# EAGLE design v0.3.0 (EAGLE 9.2.2)

## Sheet 1 of 2: Interface
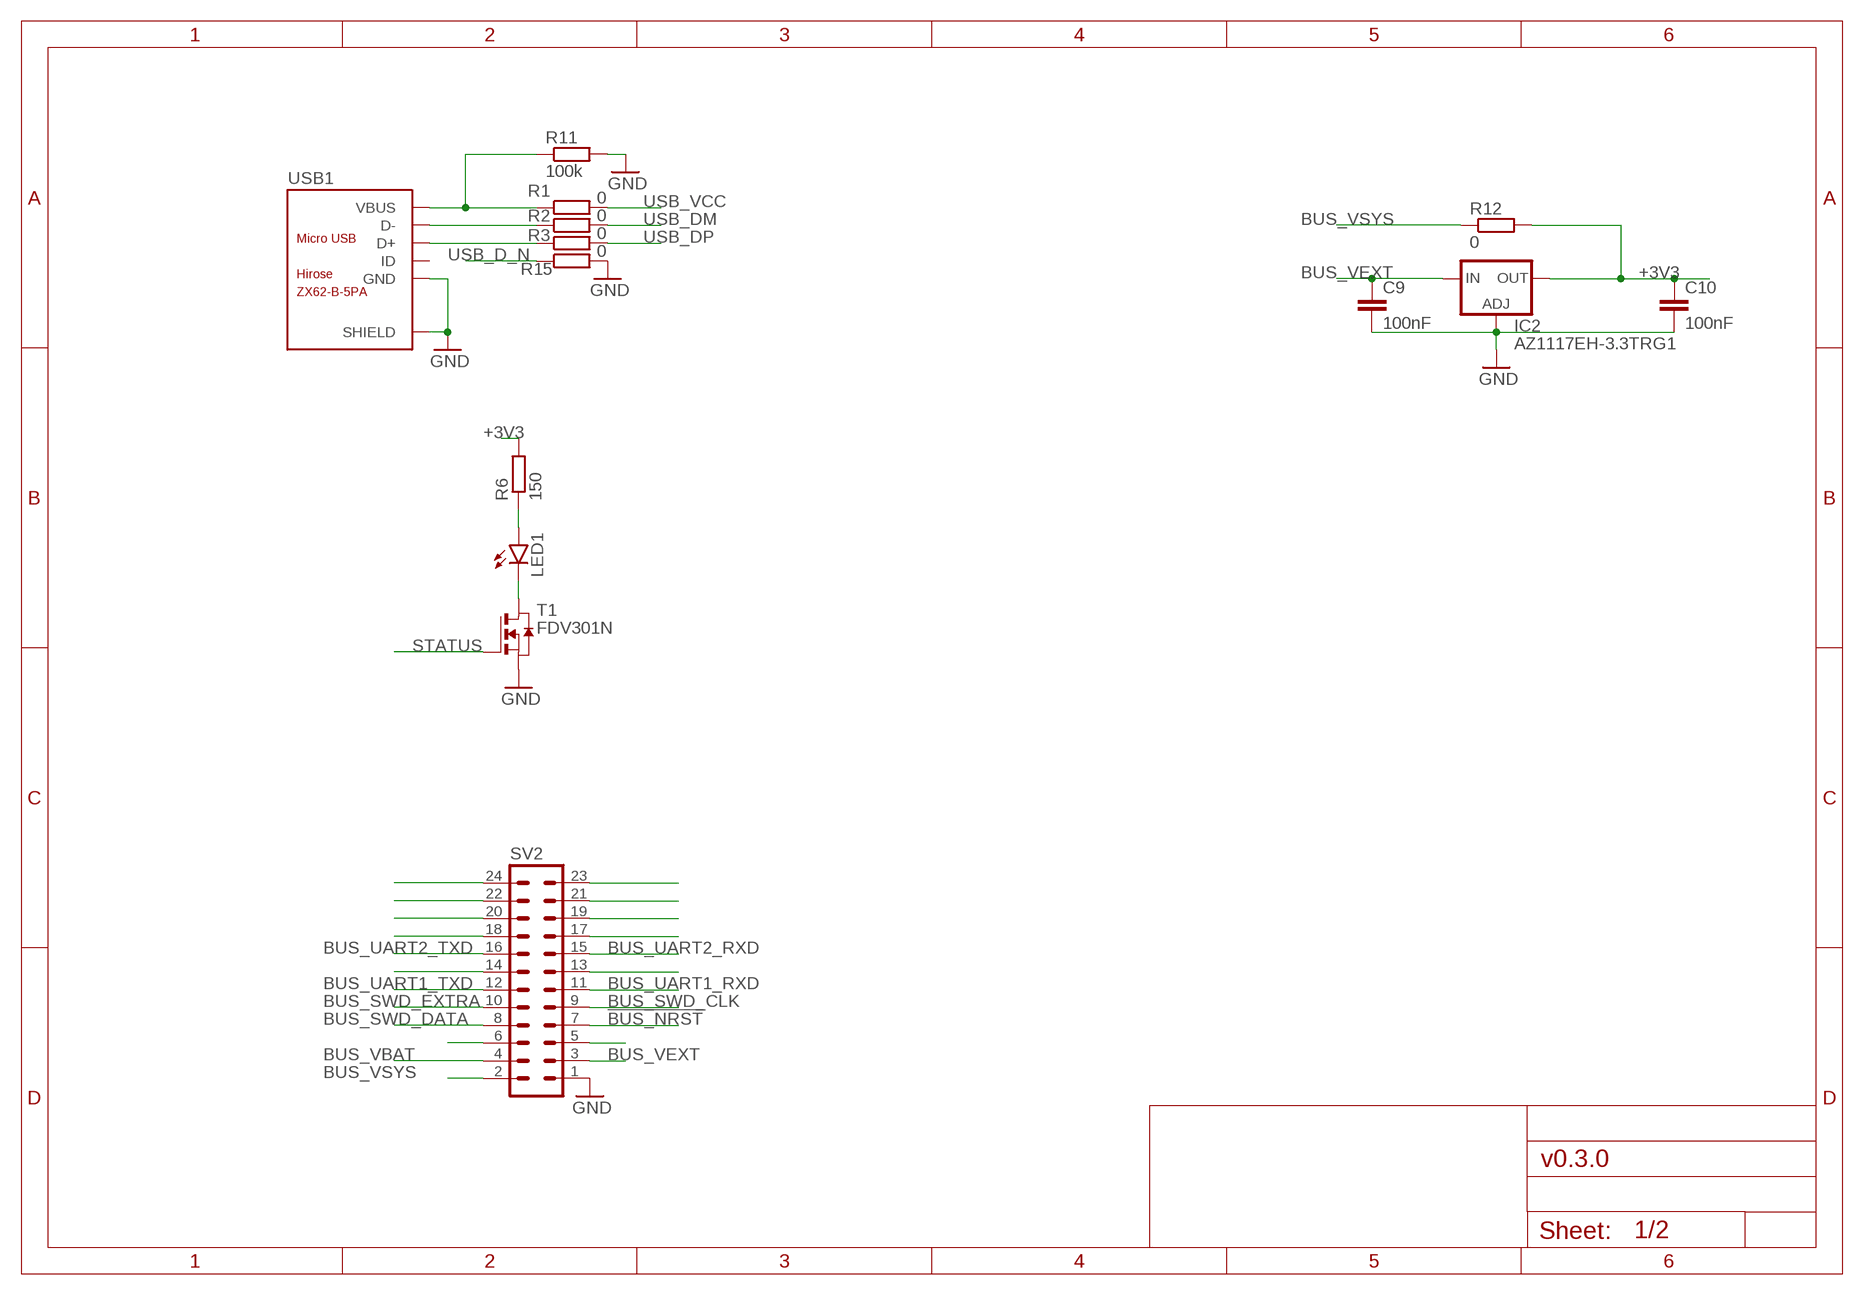
[diagram p0: schematic, sheet 1]

### Parts
C9  100nF  C-EUC0603  [C0603]
C10  100nF  C-EUC0603  [C0603]
IC2  AZ1117EH-3.3TRG1  LD117AS33TR  [SOT223]
LED1  LEDCHIP-LED0603  [CHIP-LED0603]
R1  0  R-EU_R0402  [R0402]
R2  0  R-EU_R0402  [R0402]
R3  0  R-EU_R0402  [R0402]
R6  150  R-EU_R0402  [R0402]
R11  100k  R-EU_R0402  [R0402]
R12  0  R-EU_R0402  [R0402]
R15  0  R-EU_R0402  [R0402]
SV2  MA12-2  [MA12-2]
T1  FDV301N  NMOSSOT23  [SOT-23]
USB1  ZX62-B-5PA  MICRO-USB-SMD(ZX62-B-5PA)  [MICRO-USB5+6P-SMD-0.65-AB]

### Nets
!BUS_NRST: SV2.7
+3V3: C10.1 IC2.4(OUT) R6.2 R12.2 ; also sheet 2
BUS_SWD_CLK: SV2.9
BUS_SWD_DATA: SV2.8
BUS_SWD_EXTRA: SV2.10
BUS_UART1_RXD: SV2.11 ; also sheet 2
BUS_UART1_TXD: SV2.12 ; also sheet 2
BUS_UART2_RXD: SV2.15
BUS_UART2_TXD: SV2.16
BUS_VBAT: SV2.4
BUS_VEXT: C9.1 IC2.3(IN) SV2.3
BUS_VSYS: R12.1 SV2.2
GND: C9.2 C10.2 IC2.1(ADJ) R11.2 R15.2 SV2.1 T1.2(S) USB1.5(GND) USB1.P1(SHIELD) USB1.P2(SHIELD) USB1.P3(SHIELD) USB1.P4(SHIELD) USB1.P5(SHIELD) USB1.P6(SHIELD) ; also sheet 2
N$6: LED1.C T1.1(D)
N$7: SV2.13
N$10: SV2.14
N$12: LED1.A R6.1
N$16: SV2.18
N$23: SV2.17
N$24: SV2.5
N$25: SV2.6
N$26: SV2.20
N$27: SV2.19
N$28: SV2.21
N$29: SV2.23
N$30: SV2.24
N$31: SV2.22
STATUS: T1.3(G) ; also sheet 2
USB_D_N [usb_dif]: R2.1 R15.1 USB1.2(D-)
USB_D_P [usb_dif]: R3.1 USB1.3(D+)
USB_DM [usb_dif]: R2.2 ; also sheet 2
USB_DP [usb_dif]: R3.2 ; also sheet 2
USB_VCC: R1.2 ; also sheet 2
VBUS: R1.1 R11.1 USB1.1(VBUS)
Unconnected: USB1.4(ID)

## Sheet 2 of 2: GPS modem
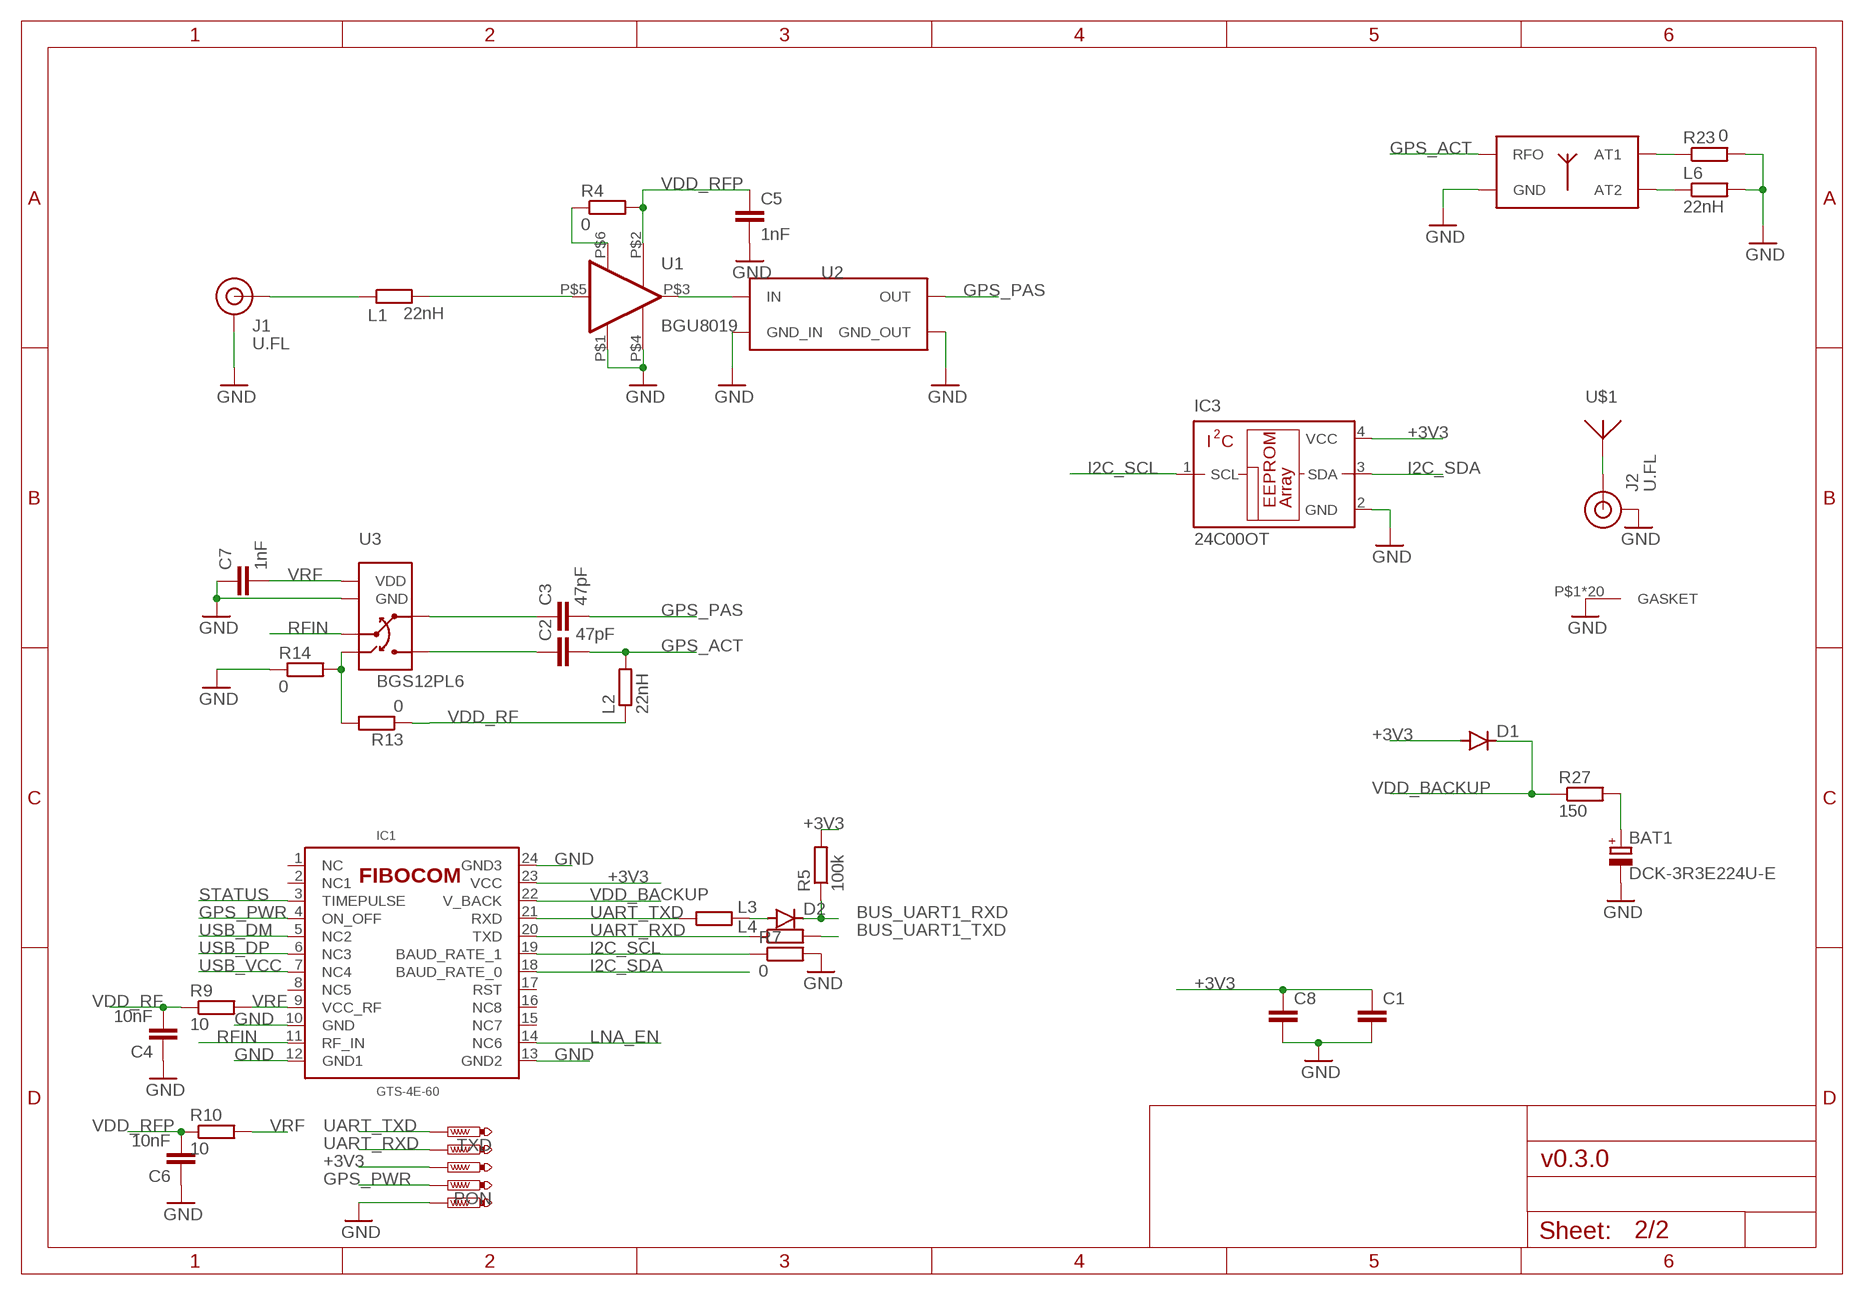
[diagram p1: schematic, sheet 2]

### Parts
3V3  PTR1B1,27  [B1,27]
ANT1  M20047  [PCBCOMPONENT_1]
BAT1  DCK-3R3E224U-E  [621]
C1  C-EUC0603  [C0603]
C2  47pF  C-EUC0402  [C0402]
C3  47pF  C-EUC0402  [C0402]
C4  10nF  C-EUC0402  [C0402]
C5  1nF  C-EUC0402  [C0402]
C6  10nF  C-EUC0402  [C0402]
C7  1nF  C-EUC0402  [C0402]
C8  C-EUC0402  [C0402]
D1  DIODE-SOD323-R  [SOD323-R]
D2  DIODE-SOD323-R  [SOD323-R]
GND  PTR1B1,27  [B1,27]
IC1  GTS-4E-60  [_GTS_4E_60]
IC3  24C00OT  [SOT23-5L]
J1  U.FL  U.FL2PIN  [U.FL]
J2  U.FL  U.FL2PIN  [U.FL]
L1  22nH  R-EU_R0402  [R0402]
L2  22nH  R-EU_R0402  [R0402]
L3  R-EU_R0402  [R0402]
L4  R-EU_R0402  [R0402]
L6  22nH  R-EU_R0402  [R0402]
PON  PTR1B1,27  [B1,27]
R4  0  R-EU_R0402  [R0402]
R5  100k  R-EU_R0402  [R0402]
R7  0  R-EU_R0402  [R0402]
R9  10  R-EU_R0402  [R0402]
R10  10  R-EU_R0402  [R0402]
R13  0  R-EU_R0402  [R0402]
R14  0  R-EU_R0402  [R0402]
R23  0  R-EU_R0402  [R0402]
R27  150  R-EU_R0402  [R0402]
RXD  PTR1B1,27  [B1,27]
TXD  PTR1B1,27  [B1,27]
U1  BGU8019  [XSON6]
U2  B3916B8813P810  [XSON5]
U3  BGS12PL6  [TSLP-6-4]
U$1  ANT1590-2540A  [2540A]
U$2  2118718-2  [2118717-2]

### Nets
+3V3: 3V3.TP C1.1 C8.1 D1.A IC1.23(VCC) IC3.4(VCC) R5.2 ; also sheet 1
BUS_UART1_RXD: D2.C R5.1 ; also sheet 1
BUS_UART1_TXD: L4.2 ; also sheet 1
GND: ANT1.2(GND) ANT1.3(GND) ANT1.4(GND) BAT1.- C1.2 C4.1 C5.2 C6.1 C7.1 C8.2 GND.TP IC1.10(GND) IC1.12(GND1) IC1.13(GND2) IC1.24(GND3) IC3.2(GND) J1.1(GND) J1.2(GND) J2.1(GND) J2.2(GND) L6.2 R7.2 R14.1 R23.2 U1.P$1(GND) U1.P$4(GND_RF) U2.2(GND_IN) U2.3(GND_OUT) U2.5(GND_IN) U3.P$2(GND) U$2.P$1(GASKET) U$2.P$2(GASKET) U$2.P$3(GASKET) U$2.P$4(GASKET) U$2.P$5(GASKET) U$2.P$6(GASKET) U$2.P$7(GASKET) U$2.P$8(GASKET) U$2.P$9(GASKET) U$2.P$10(GASKET) U$2.P$11(GASKET) U$2.P$12(GASKET) U$2.P$13(GASKET) U$2.P$14(GASKET) U$2.P$15(GASKET) U$2.P$16(GASKET) U$2.P$17(GASKET) U$2.P$18(GASKET) U$2.P$19(GASKET) U$2.P$20(GASKET) ; also sheet 1
GPS_ACT: ANT1.5(RFO) C2.2 L2.2
GPS_PAS: C3.2 U2.4(OUT)
GPS_PWR: IC1.4(ON_OFF) PON.TP
I2C_SCL: IC1.19(BAUD_RATE_1) IC3.1(SCL) R7.1
I2C_SDA: IC1.18(BAUD_RATE_0) IC3.3(SDA)
LNA_EN: IC1.14(NC6)
N$1 [50_feed]: J2.FEED(SIGNAL) U$1.P$1
N$2: U1.P$3(RF_OUT) U2.1(IN)
N$3: R4.1 U1.P$6(ENABLE)
N$4: L1.2 U1.P$5(RF_IN)
N$5 [50_feed]: J1.FEED(SIGNAL) L1.1
N$11: R13.2 R14.2 U3.P$6
N$13: C3.1 U3.P$3(RF1)
N$14: C2.1 U3.P$1(RF2)
N$17: ANT1.1(AT1) R23.1
N$18: ANT1.6(AT2) L6.1
N$20: BAT1.+ R27.2
N$21: D2.A L3.2
RFIN: IC1.11(RF_IN) U3.P$5(RFIN)
STATUS: IC1.3(TIMEPULSE) ; also sheet 1
UART_RXD: IC1.20(TXD) L4.1 RXD.TP
UART_TXD: IC1.21(RXD) L3.1 TXD.TP
USB_DM [usb_dif]: IC1.5(NC2) ; also sheet 1
USB_DP [usb_dif]: IC1.6(NC3) ; also sheet 1
USB_VCC: IC1.7(NC4) ; also sheet 1
VDD_BACKUP: D1.C IC1.22(V_BACK) R27.1
VDD_RF: C4.2 L2.1 R9.1 R13.1
VDD_RFP: C5.1 C6.2 R4.2 R10.1 U1.P$2(VCC)
VRF: C7.2 IC1.9(VCC_RF) R9.2 R10.2 U3.P$4(VDD)
Unconnected: IC1.1(NC) IC1.2(NC1) IC1.8(NC5) IC1.15(NC7) IC1.16(NC8) IC1.17(RST)

## Library data of the parts
3V3 GND PON RXD TXD = testpad:PTR1: TEST PIN
ANT1 = antenova:M20047
BAT1 = elna:DCK-3R3E224U-E
C1-C10 = rcl:C-EU: CAPACITOR, European symbol; SPICEPREFIX: C
D1 D2 = diode:DIODE-: DIODE
IC1 = parts-fibocom:GTS-4E-60: The GTS-4E is a new generation of GPS receiving module. FIBOCOM GTS 4E 60
IC2 = v-reg:LD117A?*: Low drop fixed and adjustable positive voltage regulators 1 A Source: http://www.st.com/stonline/products/literature/ds/7194/ld1117axx.pdf
IC3 = microchip:24*00: Serial EEPROM 128 bit, I2C (AA = 1.8 V/LC = 2.5 V/C = 5.0 V); MF: MICROCHIP; MPN: 24C00T-I/OT; OC_FARNELL: 1818713; OC_NEWARK: 92C6937
J1 J2 = SparkFun-Connectors:U.FL2PIN: SMD Antenna Connector - U.FL 2mm height, 3.0mm x 3.0mm receptacle size. SparkFun Products: SparkFun WiFi Shield - ESP8266 <https://www.sparkfun.com/products/13287> SparkFun ESP8266 Thing <https://www.sparkfun.com/products/13231> SparkFun MiniGen - Pro Mini Signal Generator Shield <https://www.sparkfun.com/products/11420>; PROD_ID: CONN-09193; SF_ID: WRL-09144
L1-L4 L6 R1-R7 R9-R15 R23 R27 = rcl:R-EU_: RESISTOR, European symbol; SPICEPREFIX: R
LED1 = led:LED: LED OSRAM: - CHIPLED LG R971, LG N971, LY N971, LG Q971, LY Q971, LO R971, LY R971 LH N974, LH R974 LS Q976, LO Q976, LY Q976 LO Q996 - Hyper CHIPLED LW Q18S LB Q993, LB Q99A, LB R99A - SideLED LS A670, LO A670, LY A670, LG A670, LP A670 LB A673, LV A673, LT A673, LW A673 LH A674 LY A675 LS A676, LA A676, LO A676, LY A676, LW A676 LS A679, LY A679, LG A679 - Hyper Micro SIDELED® LS Y876, LA Y876, LO Y876, LY Y876 LT Y87S - SmartLED LW L88C, LW L88S LB L89C, LB L89S, LG L890 LS L89K, LO L89K, LY L89K LS L896, LA L896, LO L896, LY L896 - TOPLED LS T670, LO T670, LY T670, LG T670, LP T670 LSG T670, LSP T670, LSY T670, LOP T670, LYG T670 LG T671, LOG T671, LSG T671 LB T673, LV T673, LT T673, LW T673 LH T674 LS T676, LA T676, LO T676, LY T676, LB T676, LH T676, LSB T676, LW T676 LB T67C, LV T67C, LT T67C, LS T67K, LO T67K, LY T67K, LW E67C LS E67B, LA E67B, LO E67B, LY E67B, LB E67C, LV E67C, LT E67C LW T67C LS T679, LY T679, LG T679 LS T770, LO T770, LY T770, LG T770, LP T770 LB T773, LV T773, LT T773, LW T773 LH T774 LS E675, LA E675, LY E675, LS T675 LS T776, LA T776, LO T776, LY T776, LB T776 LHGB T686 LT T68C, LB T68C - Hyper Mini TOPLED® LB M676 - Mini TOPLED Santana® LG M470 LS M47K, LO M47K, LY M47K Source: http://www.osram.convergy.de LUXEON: - LUMILED® LXK2-PW12-R00, LXK2-PW12-S00, LXK2-PW14-U00, LXK2-PW14-V00 LXK2-PM12-R00, LXK2-PM12-S00, LXK2-PM14-U00 LXK2-PE12-Q00, LXK2-PE12-R00, LXK2-PE12-S00, LXK2-PE14-T00, LXK2-PE14-U00 LXK2-PB12-K00, LXK2-PB12-L00, LXK2-PB12-M00, LXK2-PB14-N00, LXK2-PB14-P00, LXK2-PB14-Q00 LXK2-PR12-L00, LXK2-PR12-M00, LXK2-PR14-Q00, LXK2-PR14-R00 LXK2-PD12-Q00, LXK2-PD12-R00, LXK2-PD12-S00 LXK2-PH12-R00, LXK2-PH12-S00 LXK2-PL12-P00, LXK2-PL12-Q00, LXK2-PL12-R00 Source: www.luxeon.com KINGBRIGHT: KA-3528ASYC Source: www.kingbright.com
SV2 = con-lstb:MA12-2: PIN HEADER; OC_FARNELL: unknown; OC_NEWARK: unknown
T1 = zetex:NMOSSOT23: MOS FET; OC_FARNELL: unknown; OC_NEWARK: unknown
U1 = nxp:BGU8019
U2 = rf360:B3916
U3 = parts-infineon:BGS12PL6
U$1 = sr-passives:ANT1590-
U$2 = parts-te_conn:2118718-2
USB1 = Seeed-Connector:MICRO-USB-SMD(ZX62-B-5PA): 320010005; MPN: ZX62-B-5PA

## Net classes
1 50_feed: width 1 mm, clearance 0.4 mm
2 usb_dif: width 0.4 mm, clearance 0.8 mm

## Board
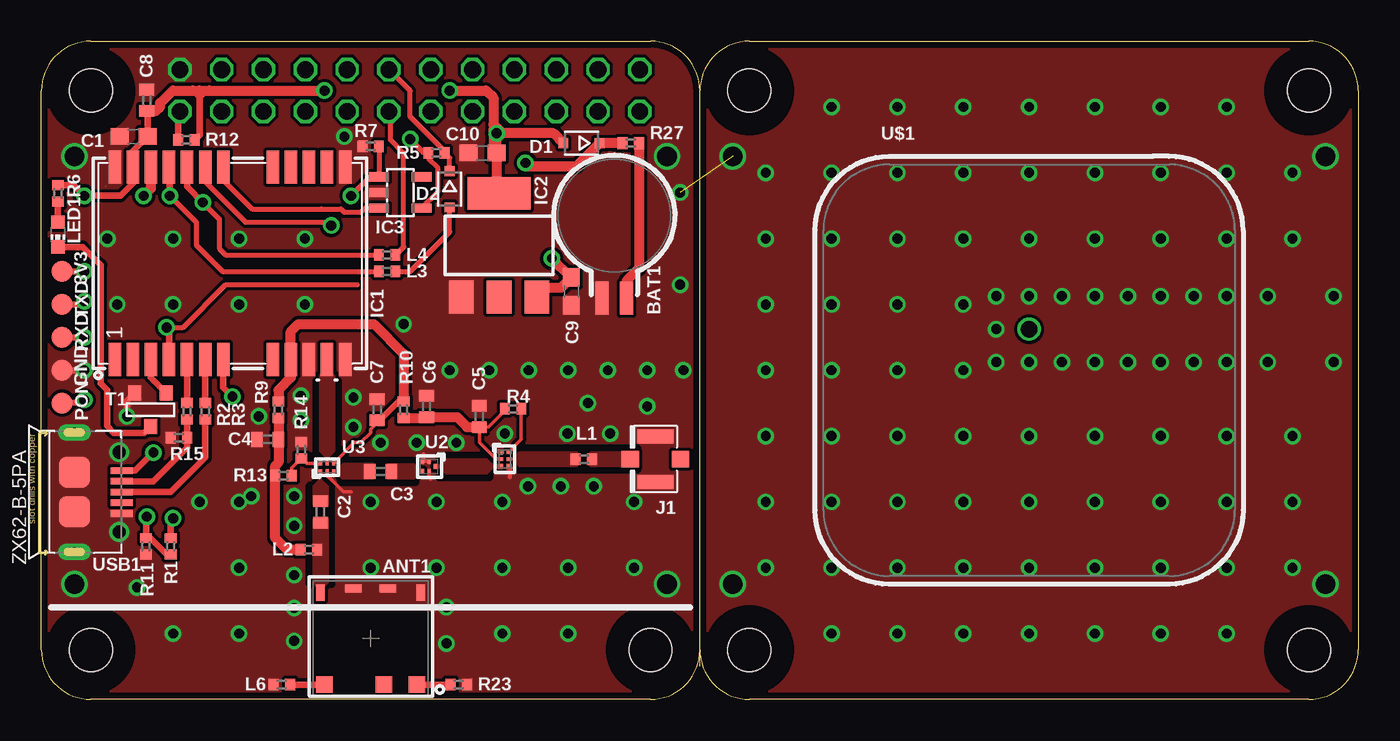
[diagram p2: board, top side]
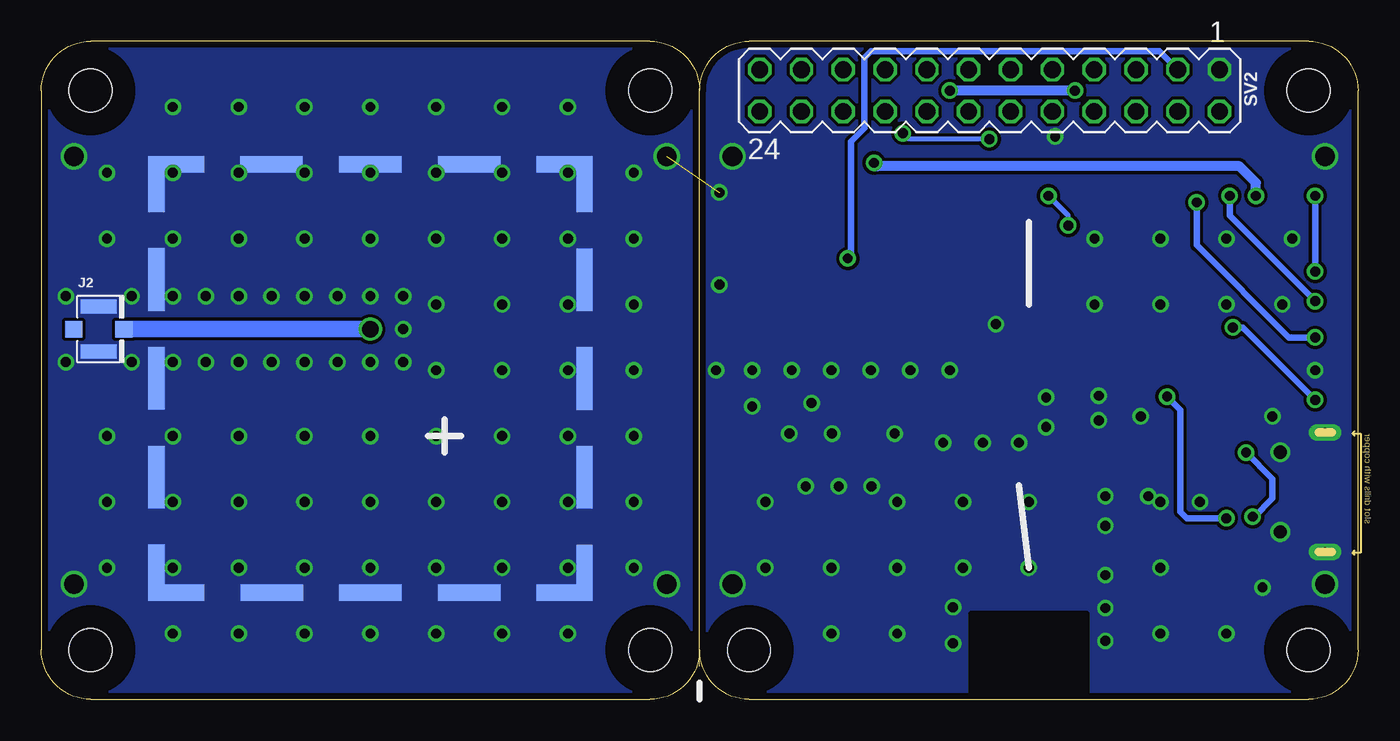
[diagram p3: board, bottom side, seen from below]

Size 80 x 40 mm. Coordinates in mm from the lower left corner, seen from the top.
Outline: 40,37 arc-90 43,40 77,40 arc-90 80,37 80,3 arc-90 77,0 43,0 arc-90 40,3
Outline: 40,2 40,3
Outline: 40,3 arc-90 37,0 3,0 arc-90 0,3 0,37 arc-90 3,40 37,40 arc-90 40,37
Outline: 40,3 40,37
Copper layers (1*16): Top 0.035mm / dielectric 0.53mm / Bottom 0.035mm
Design rules "default *": minimum track width 0.2mm, minimum drill 0.6mm, track to track 0.2mm, track to pad 0.2mm, pad to pad 0.2mm, via to via 0.2mm, smd to smd 6mil, copper to edge 0.4mm, drill to drill 0.2mm, minimum pad ring 0.2mm, minimum via ring 0.2mm, stop-mask expansion 0.1mm, vias tented up to drill 0.6mm, thermal gap 10mil
Holes 2.6 mm at 3,37 3,3 43,37 77,37 43,3 77,3 37,3
tRestrict: area 0.5,34.5 to 5.5,39.5; area 0.5,0.5 to 5.5,5.5; area 40.5,34.5 to 45.5,39.5; area 74.5,34.5 to 79.5,39.5; area 40.5,0.5 to 45.5,5.5; area 74.5,0.5 to 79.5,5.5; area 34.5,0.5 to 39.5,5.5; 10 lines
bRestrict: area 0.5,34.5 to 5.5,39.5; area 0.5,0.5 to 5.5,5.5; area 40.5,34.5 to 45.5,39.5; area 74.5,34.5 to 79.5,39.5; area 40.5,0.5 to 45.5,5.5; area 74.5,0.5 to 79.5,5.5; area 34.5,0.5 to 39.5,5.5

### Footprints (pad centres in the part's own frame; a part is rotated, then mirrored left to right if it is on the bottom)
B1,27 = smd 1.27 x 1.27: TP 0,0
PCBCOMPONENT_1 = smd 1 x 1: 1 -2.8,2.8; 6 2.8,2.8; 7 -0.8,2.8 | smd 0.5 x 1: 2 -3.05,-2.794; 5 3.05,-2.794 | smd 1 x 0.5: 3 -1.05,-3.048; 4 1.05,-3.048
621 = smd 0.8 x 2: + 0.75,-1.6; - -0.75,-1.6
C0603 = smd 1.1 x 1: 1 -0.85,0; 2 0.85,0
C0402 = smd 0.7 x 0.9: 1 -0.65,0; 2 0.65,0
SOD323-R = smd 0.6 x 0.6: A 1.1,0; C -1.1,0
_GTS_4E_60 = smd 0.76 x 2: 1 -7,-5.85; 2 -5.9,-5.85; 3 -4.81,-5.85; 4 -3.7,-5.85; 5 -2.6,-5.85; 6 -1.5,-5.85; 7 -0.4,-5.85; 8 2.6,-5.85; 9 3.7,-5.85; 10 4.8,-5.85; 11 5.9,-5.85; 12 7,-5.85; 13 7,5.85; 14 5.9,5.85; 15 4.8,5.85; 16 3.7,5.85; 17 2.6,5.85; 18 -0.4,5.85; 19 -1.5,5.85; 20 -2.6,5.85; 21 -3.7,5.85; 22 -4.8,5.85; 23 -5.9,5.85; 24 -7,5.85
SOT223 = smd 1.5 x 2: 1 -2.3,-3.15; 2 0,-3.15; 3 2.3,-3.15 | smd 3.8 x 2: 4 0,3.15
SOT23-5L = smd 0.55 x 1.2: 1 -0.95,-1.3; 2 0,-1.3; 3 0.95,-1.3; 4 0.95,1.3; 5 -0.95,1.3
U.FL = smd 2.2 x 0.85: 1 0,1.375; 2 0,-1.375 | smd 1.05 x 1: FEED 1.525,0; NC -1.525,0
R0402 = smd 0.6 x 0.7: 1 -0.5,0; 2 0.5,0
CHIP-LED0603 = smd 0.8 x 0.8: A 0,-0.75; C 0,0.75
MA12-2 = drill 1.016 octagon: 1 -13.97,-1.27; 2 -13.97,1.27; 3 -11.43,-1.27; 4 -11.43,1.27; 5 -8.89,-1.27; 6 -8.89,1.27; 7 -6.35,-1.27; 8 -6.35,1.27; 9 -3.81,-1.27; 10 -3.81,1.27; 11 -1.27,-1.27; 12 -1.27,1.27; 13 1.27,-1.27; 14 1.27,1.27; 15 3.81,-1.27; 16 3.81,1.27; 17 6.35,-1.27; 18 6.35,1.27; 19 8.89,-1.27; 20 8.89,1.27; 21 11.43,-1.27; 22 11.43,1.27; 23 13.97,-1.27; 24 13.97,1.27
SOT-23 = smd 0.787 x 0.889: 1 0.025,-1.016; 2 -0.94,1.016; 3 0.991,1.016
XSON6 = smd 0.3 x 0.3: P$1 0.25,-0.45; P$3 0.25,0.45; P$4 -0.25,0.45; P$6 -0.25,-0.45 | smd 0.3 x 0.2: P$2 0.25,0; P$5 -0.25,0
XSON5 = smd 0.25 x 0.3: 1 -0.4,0 | smd 0.2 x 0.3: 2 0,-0.3; 3 0.4,-0.3; 4 0.4,0.3; 5 0,0.3
TSLP-6-4 = smd 0.25 x 0.2: P$1 0.25,-0.4; P$2 0.25,0; P$3 0.25,0.4; P$4 -0.25,0.4; P$5 -0.25,0; P$6 -0.25,-0.4
2540A = drill 1: P$1 0,2.5
2118717-2 = smd 1 x 3.41: P$1 0.5,1.705; P$11 26.51,25.305 | smd 1 x 3.8: P$2 0.5,7.51; P$3 0.5,13.51; P$4 0.5,19.51; P$12 26.51,19.5; P$13 26.51,13.5; P$14 26.51,7.5 | smd 1 x 3.4: P$5 0.5,25.31; P$15 26.51,1.7 | smd 3.41 x 1: P$6 1.705,0.5; P$16 25.305,26.51 | smd 3.8 x 1: P$7 7.51,0.5; P$8 13.51,0.5; P$9 19.51,0.5; P$17 19.5,26.51; P$18 13.5,26.51; P$19 7.5,26.51 | smd 3.4 x 1: P$10 25.31,0.5; P$20 1.7,26.51
MICRO-USB5+6P-SMD-0.65-AB = smd 0.4 x 1.35: 1 -1.3,2.875; 2 -0.65,2.875; 3 0,2.875; 4 0.65,2.875; 5 1.3,2.875 | smd 1.9 x 1.9: P1 -1.2,0; P2 1.2,0 | drill 0.508 pad 1.016 long: P3 -3.625,0; P4 3.625,0 | drill 0.8: P5 -2.425,2.73; P6 2.425,2.73

### Placement (x,y rotation side)
3V3  1.25,26 0 top
ANT1  20,3.7 180 top
BAT1  34.8,26 0 top
C1  5.6,34.2 180 top
C2  16.95,11.4 270 top
C3  20.6,13.85 0 top
C4  13.75,15.8 0 top
C5  26.6,17.2 90 top
C6  23.4,17.8 270 top
C7  20.4,17.6 270 top
C8  6.4,36.4 90 top
C9  32.2,24.8 270 top
C10  26.8,33.2 180 top
D1  32.8,33.8 180 top
D2  24.8,31 270 top
GND  1.25,20 0 top
IC1  11.45,26.5 0 top
IC2  27.8,27.6 0 top
IC3  21.8,30.8 270 top
J1  37.3,14.6 180 top
J2  76.5,22.5 0 bottom
L1  32.95,14.6 180 top
L2  16.25,9.1 0 top
L3  21,26 0 top
L4  21,27 0 top
L6  14.6,0.9 180 top
LED1  1,28.25 180 top
PON  1.25,18 90 top
R1  7.85,9.3 90 top
R2  8.85,17.5 90 top
R3  9.95,17.5 90 top
R4  28.65,17.65 180 top
R5  24,33.2 180 top
R6  1,30.75 90 top
R7  20,33.6 180 top
R9  14.4,17.6 90 top
R10  22,17.6 90 top
R11  6.35,9.3 270 top
R12  8.8,34 0 top
R13  14.7,13.6 0 top
R14  15.8,15.15 270 top
R15  8.35,15.9 180 top
R23  25.35,0.9 0 top
R27  35.8,33.8 0 top
RXD  1.25,22 90 top
SV2  22.38,37 180 bottom
T1  6.6,17.6 0 top
TXD  1.25,24 90 top
U1  28.15,14.6 180 top
U2  23.55,14.15 180 top
U3  17.35,14.1 270 top
U$1  60,20 0 top
U$2  73.5,6 0 bottom
USB1  2,12.6 270 top

### Tracks (layer width: path | path; a pad name or v marks a point on that pad's centre or on a via)
+3V3  (via drill 0.6)
  Top 0.3: IC3.4 24.05,30.8 24.05,32.35 23.5,32.9 R5.2 23.25,33.2 v22.4,34.05
  Top 0.4: R6.2 1.95,31.25 v2.6,30.6 4.8,30.6 5.6,31.4 5.55,31.45 IC1.23 5.55,33.3 C1.1 6.45,35.7 C8.1 | 3V3.TP v2.6,26 | R12.2 9.6,34.3 9.6,36.6 | 9.6,36.6 9.6,37 | 9.6,36.6 10,37 10.2,37 | 9.6,36.6 9.2,37
  Top 0.6: C8.1 6.95,35.75 7.2,36 7.2,36.23 7.97,37 9.2,37 9.6,37 10.2,37 v17.2,37 | D1.A 31.1,34.4 28,34.4 | IC2.4 27.65,30.9 C10.1 27.62,33.23 | 27.62,33.23 27.45,33.4 27.45,34.6 | 27.45,34.95 27.45,36.55 27,37 v24.8,37 | 27.45,34.95 27.45,34.6 | 27.45,34.6 v27.65,34.4 28,34.4 | 28,34.4 27.45,34.95 | 28,34.4 27.62,34.02 27.62,33.23
  Bottom 0.3: v22.4,34.05 27.3,34.05 v27.65,34.4
  Bottom 0.4: v2.6,26 v2.6,30.6
  Bottom 0.6: v17.2,37 v24.8,37
BUS_UART1_RXD
  Top 0.3: D2.C 24.8,32.9 R5.1 | SV2.11 22.4,36.98 22.4,35.4 24.5,33.3 24.55,33.3 24.5,33.34
  Top 0.4: R5.1 24.5,33.3
BUS_UART1_TXD
  Top 0.3: L4.2 22,27.5 22,33.2 21.2,34 21.2,35.64 SV2.12
BUS_VEXT  (via drill 0.6)
  Top 0.6: v31,26.8 32.15,25.65 C9.1 31.55,25 30.65,25 IC2.3
  Bottom 0.4: SV2.3 12.08,39.4 29.6,39.4 30,39 30,34.7 30.8,33.9 30.8,27 v31,26.8
BUS_VSYS
  Top 0.4: SV2.2 8.3,35.62 R12.1
GND  (via drill 0.6, 1.2)  (1 unrouted)
  Top 0.2: U2.5 23.55,13.5 23.65,13.4 | U2.3 23.15,14.85 23.2,14.9 23.2,14.45 U2.2 | 18.8,12.6 18.35,12.6 17.35,13.6 U3.P$2
  Top 0.25: U1.P$4 28.45,14.1 28.45,13.5
  Top 0.4: T1.2 5.2,18.16 v5.2,17.2 | GND.TP v2.6,20
  other vias: 2,33 2,7 38,7 38,33 42,33 42,7 78,7 78,33 72,24.5 60,24.5 62,24.5 64,24.5 66,24.5 68,24.5 70,24.5 74.5,24.5 78.5,24.5 78.5,20.5 60,20.5 62,20.5 64,20.5 66,20.5 68,20.5 70,20.5 72,20.5 74.5,20.5 58,24.5 58,22.5 58,20.5 44,8 48,8 48,12 44,12 56,12 52,12 52,8 56,8 44,16 48,16 48,20 44,20 56,20 52,20 52,16 56,16 60,16 64,16 68,16 72,16 76,16 72,12 68,12 68,8 72,8 76,12 76,8 60,8 64,8 64,12 60,12 48,4 56,4 52,4 64,4 60,4 72,4 68,4 44,24 48,24 48,28 44,28 56,28 52,28 52,24 56,24 64,28 60,28 72,28 68,28 76,28 44,32 48,32 48,36 56,36 52,36 52,32 56,32 60,32 64,32 64,36 60,36 72,36 68,36 68,32 72,32 76,32 28.15,16.15 31.95,16.15 34.55,16.15 29.55,12.95 31.55,12.95 33.55,12.95 15.75,18.45 15.75,16.95 18.95,18.35 18.95,16.55 8,4 12,4 28,4 32,4 5.8,6.8 12,8 20,8 24,8 28,8 32,8 36,8 12,12 20,12 24,12 28,12 36,12 9.6,12 13.2,17.2 25.2,15.6 24.8,20 33.2,18 32,20 36.8,20 4.6,24 8,24 12,24 16,24 22,22.8 27.2,20 29.6,20 39,20 36.8,17.8 4,28 8,28 12,28 16,28 18.4,34.2 34.4,20 38.8,25.2 38.8,30.8 20.6,15.6 12.75,12.35 15.35,12.35 15.35,10.55 15.35,7.55 15.35,5.55 15.35,3.55 24.6,5.6 24.6,3.4 22.8,15.6
  pour Bottom (isolate 0.2, no thermals): -1,-1 81,-1 81,41 -1,41
  pour Top (isolate 0.2, rank 6, no thermals): -2,-2 82,-2 82,42 -2,42
GPS_ACT
  pour Top (no thermals): 17.15,6.85 17.4,7.1 17.4,10.95 17.3,11.05 16.6,11.05 16.5,10.95 16.5,7.1 16.75,6.85 16.75,6.4 17.15,6.4
GPS_PAS
  pour Top (no thermals): 23.15,13.95 23,13.95 22.65,14.3 21.05,14.3 20.95,14.2 20.95,13.5 21.05,13.4 22.65,13.4 23,13.75 23.15,13.75
GPS_PWR  (via drill 0.6)
  Top 0.3: v7.6,22.6 8.6,22.6 11.2,25.2 19.2,25.2
  Top 0.4: IC1.4 7.75,22.45 v7.6,22.6 | v2.6,18.2 2.45,18.05 PON.TP
  Bottom 0.4: v2.6,18.2 7,22.6 v7.6,22.6
I2C_SCL  (via drill 0.6)
  Top 0.3: IC1.19 9.95,31.45 12.4,29 17.4,29 v17.6,28.8 | R7.1 IC3.1 19.95,31.75 v18.8,30.6
  Bottom 0.3: v17.6,28.8 17.6,29.4 v18.8,30.6
I2C_SDA
  Top 0.3: IC1.18 11.05,31.55 12.8,29.8 17,29.8 18.2,29.8 18.4,29.6 19.4,29.6 19.65,29.85 IC3.3
N$1
  Bottom 1: U$1.P$1 J2.FEED
N$2
  pour Top (no thermals): 27.9,14.25 27.4,14.25 27.05,14.6 26.55,14.6 26.55,13.7 27.05,13.7 27.4,14.05 27.9,14.05
  pour Top (no thermals): 23.95,14.25 24.25,14.25 24.6,14.6 26.65,14.6 26.65,13.7 24.6,13.7 24.25,14.05 23.95,14.05
N$3
  Top 0.2: U1.P$6 29.15,15.8 R4.1
N$4
  pour Top (no thermals): 28.4,14.65 28.65,14.65 29.05,15.05 32.25,15.05 32.25,14.15 29.05,14.15 28.65,14.55 28.4,14.55
  pour Top (no thermals): 32.7,14.85 32.5,15.05 32.05,15.05 32.05,14.15 32.5,14.15 32.7,14.35
N$5
  pour Top (no thermals): 33.2,14.7 33.2,14.85 33.4,15.05 36.15,15.05 36.25,14.95 36.25,14.25 36.15,14.15 33.4,14.15 33.2,14.35
N$6
  Top 0.4: LED1.C 2.5,27.5 3.6,26.4 3.6,19.2 4,18.8 4,16.6 4.4,16.2 6.24,16.2 T1.1
N$11
  Top 0.2: U3.P$6 16.1,14.35 R14.2 15.2,14.05 R13.2
N$12
  Top 0.4: LED1.A R6.1
N$13
  pour Top (no thermals): 17.7,13.95 17.95,13.95 18.35,14.35 20.15,14.35 20.25,14.25 20.25,13.5 20.15,13.4 18.3,13.4 17.95,13.75 17.7,13.75
N$14
  pour Top (no thermals): 16.9,13.9 16.9,13.35 16.5,12.95 16.5,11.85 16.6,11.75 17.3,11.75 17.4,11.85 17.4,12.95 17,13.35 17,13.9
N$17
  Top 0.4: ANT1.1 R23.1
N$18
  Top 0.4: ANT1.6 L6.1
N$20
  Top 0.6: R27.2 36.3,26.2 35.55,25.45 BAT1.+
N$21
  Top 0.3: L3.2 22.4,26 24.8,28.4 D2.A
RFIN
  pour Top (no thermals): 17.3,14.35 17.3,14.7 16.9,15.1 16.9,19.65 17.05,19.8 17.05,20.8 17.65,20.8 17.65,19.8 17.8,19.65 17.8,15.1 17.4,14.7 17.4,14.35
STATUS
  Top 0.4: IC1.3 6.64,19.57 T1.3
UART_RXD  (via drill 0.6)
  Top 0.3: L4.1 11.2,27 10.8,27.4 10.8,29.2 v9.8,30.2
  Top 0.4: RXD.TP v2.6,22 | v9.8,30.2 8.85,31.15 IC1.20
  Bottom 0.4: v2.6,22 4.2,22 9.8,27.6 v9.8,30.2
UART_TXD  (via drill 0.6)
  Top 0.3: v7.8,30.6 9.4,29 9.4,27.6 11,26 L3.1
  Top 0.4: v7.8,30.6 7.8,32.3 IC1.21 | TXD.TP 2.4,24 v2.6,24.2
  Bottom 0.4: v2.6,24.2 7.8,29.4 v7.8,30.6
USB_D_N
  Top 0.4: USB1.2 6.8,13.25 8.85,15.3 R15.1 R2.1
USB_D_P
  Top 0.4: USB1.3 7.85,12.6 9.95,14.7 R3.1
USB_DM
  Top 0.4: IC1.5 R2.2 | R2.2
USB_DP
  Top 0.4: IC1.6 R3.2 | R3.2
USB_VCC  (via drill 0.6)
  Top 0.4: R1.2 7.85,10.85 v8,11 | IC1.7 11.05,18.95 v11.6,18.4
  Bottom 0.4: v11.6,18.4 10.8,17.6 10.8,11.4 10.4,11 v8,11
VBUS  (via drill 0.6)
  Top 0.4: USB1.1 5.7,13.9 v6.8,15 | v6.4,11.1 6.35,11.05 R11.1 6.6,9.8 7.6,8.8 R1.1
  Bottom 0.4: v6.8,15 5.2,13.4 5.2,12.2 6.3,11.1 v6.4,11.1
VDD_BACKUP  (via drill 0.6)
  Top 0.6: IC1.22 6.65,31.05 v6.2,30.6 | R27.1 D1.C 32.5,32.4 29.6,32.4 v29.4,32.6
  Bottom 0.6: v6.2,30.6 6.2,31.4 7.2,32.4 29.2,32.4 v29.4,32.6
VDD_RF
  Top 0.6: L2.1 14.9,9.1 14.2,9.8 R13.1 14.2,14.2 14.4,14.4 C4.2 R9.1
VDD_RFP
  Top 0.2: U1.P$2 27.63,14.6 26.6,15.63 C5.1 27.15,16.55 28.15,17.55 R4.2
  Top 0.6: R10.1 23.35,17.1 C6.2 25.25,17.15 25.85,16.55 C5.1
VRF
  Top 0.2: U3.P$4 19,15.6 19.4,15.6 20,16.2 20,16.4 20.55,16.95
  Top 0.4: R10.2 21.7,18.1 20.55,16.95 C7.2
  Top 0.6: R9.2 14.4,18.8 15.15,19.55 IC1.9 15.15,22.35 15.6,22.8 20.2,22.8 22,21 R10.2